# Altium schematic sheet IO and Connectors.SchDoc
size Letter; DocumentNumber: 6; SheetNumber: 6; SheetTotal: 7
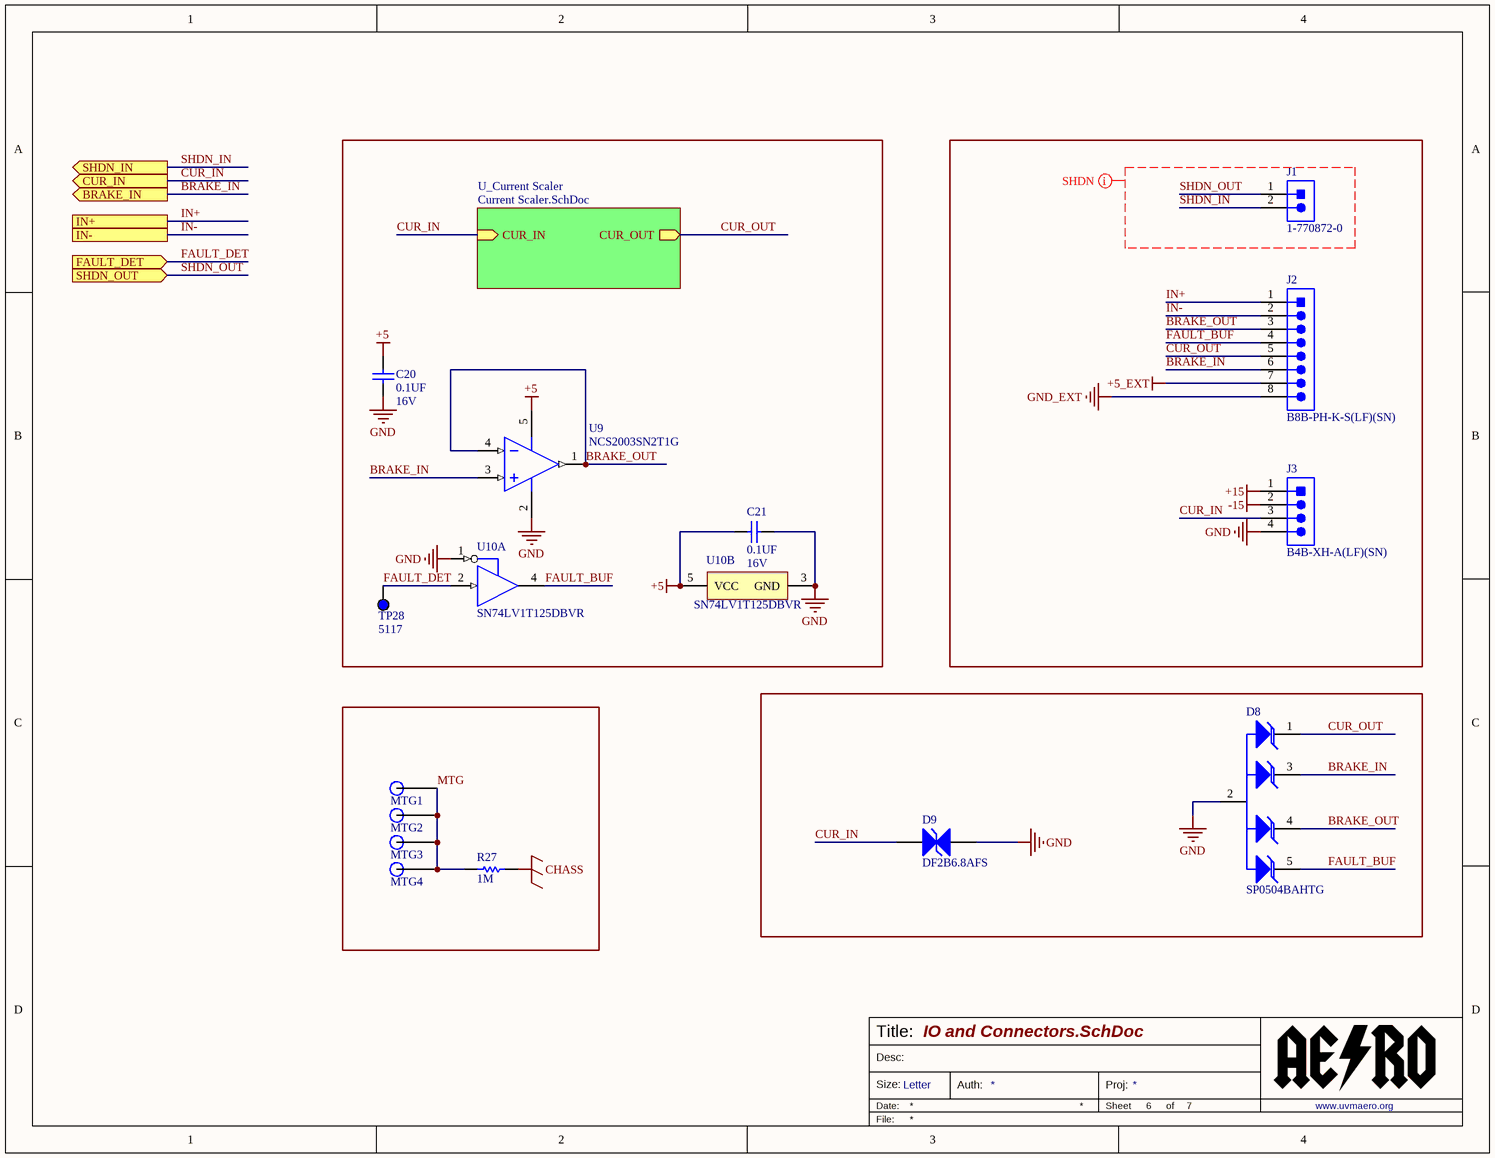
[diagram p0: IO and Connectors.SchDoc]

## Parts
C20  Val: 0.1UF  Vol: 16V  [0603_CAP]  (hidden comment: CAP 0603 0.1UF 16V 10% X7R)
C21  Val: 0.1UF  Vol: 16V  [0603_CAP]  (hidden comment: CAP 0603 0.1UF 16V 10% X7R)
D8  SP0504BAHTG  [SOT23127P600-8N]
D9  DF2B6.8AFS  [SOD923]
J1  1-770872-0  [CON2_1X2_P163_VM_ALT]
J2  B8B-PH-K-S(LF)(SN)  [B8B-PH-K]
J3  B4B-XH-A(LF)(SN)  [B4B-XH-A(LF)(SN)]
MTG1  PCB MTG M3  [MTG-M3]  (value not drawn)  (no BOM)
MTG2  PCB MTG M3  [MTG-M3]  (value not drawn)  (no BOM)
MTG3  PCB MTG M3  [MTG-M3]  (value not drawn)  (no BOM)
MTG4  PCB MTG M3  [MTG-M3]  (value not drawn)  (no BOM)
R27  value 1M  [RESC2013X60X35ML10T20]  (hidden comment: RT0805BRE071ML)
TP28  5117  [KSTN-5117]
U9  NCS2003SN2T1G  [ONSC-TSOP-5-483-02_V]
U10  SN74LV1T125DBVR  [DBV0005A_M]  (parts A,B of 2)

## Sub-sheets
U_Current Scaler = Current Scaler.SchDoc: CUR_IN (in), CUR_OUT (out)

## Ports
BRAKE_IN (out), CUR_IN (out), FAULT_DET (in), IN+, IN-, SHDN_IN (out), SHDN_OUT (in)

## Nets
+5: C20.2 C21.2 U9.5(VDD) U10.5(VCC)
+5_EXT: J2.7
+15: J3.1
-15: J3.2
CHASS: R27.1
GND: C20.1 C21.1 D8.2 D9.2(A2) J3.4 U9.2(VSS) U10.1(~{OE}) U10.3(GND)
GND_EXT: J2.8
BRAKE_IN: D8.3 J2.6 U9.3(IN+) ; port BRAKE_IN
BRAKE_OUT: D8.4 J2.3 U9.1(VOUT) U9.4(IN-)
CUR_IN: D9.1(A1) J3.3 ; port CUR_IN, sheet U_Current Scaler/CUR_IN
CUR_OUT: D8.1 J2.5 ; sheet U_Current Scaler/CUR_OUT
FAULT_BUF: D8.5 J2.4 U10.4(Y)
FAULT_DET: TP28.1 U10.2(A) ; port FAULT_DET
IN+: J2.1 ; port IN+
IN-: J2.2 ; port IN-
MTG: MTG1.1 MTG2.1 MTG3.1 MTG4.1 R27.2
SHDN_IN: J1.2 ; port SHDN_IN
SHDN_OUT: J1.1 ; port SHDN_OUT

## Layout directives
net class PWR; net class HC: SHDN_IN, SHDN_OUT

## Notes on the sheet
- Title:
- Size:
- Date:
- Desc:
- Letter
- Auth:
- Sheet
- Proj:
- of
- www.uvmaero.org
- File:

## Library data of the parts
C20 C21 = CAP 0603 0.1UF 16V 10% X7R: Capacitor Surface Mount 0603 Footprint 0.1UF 16V 10% Tolerance Ceramic X7R; Manufacturer: Various; PCB Package: 0603; Description in Visual: Cap SMT 0603 0.1UF 16V 10%  Cer X7R; P/N: CAP 0603 0.1UF 16V 10% X7R; Manufacturer P/N: Various; Value: 0.1UF; Voltage: 16V; Tolerance: 10%; Type: Ceramic X7R; ComponentLink1Description: Manufacturer Website; ComponentLink2Description: Component Datasheet; ComponentLink3Description: Octopart Link
D8 = SP0504BAHTG: 8.5V Clamp  Ipp Tvs Diode Surface Mount SOT-23-5 5.5V; Manufacturer: Littelfuse; Capacitance: 30pF; Diode Type: Avalanche; Direction: Unidirectional; Element Configuration: Common Anode; ESD Protection: Yes; Leakage Current: 100nA; Max Power Dissipation: 225mW; Number of Channels: 4; Polarity: Bidirectional,Unidirectional; Power Line Protection: No; Voltage Rating (DC): 5V; Breakdown Voltage: 5.5V; Case/Package: SOT-23; Category: TVS Diodes; Clamping Voltage: 8.5V; Composition: Zener; Depth: 1.75mm; Height: 1.3mm; Lead Free: Lead Free; Length: 3.05mm; Manufacturer Part Number: SP0504BAHTG; Max Operating Temperature: 85°C; Max Reverse Leakage Current: 100nA; Min Operating Temperature: -40°C; Mount: Surface Mount; Number of Elements: 4; Number of Pins: 5; Number of Unidirectional Channels: 4; Packaging: Tape and Reel; Peak Pulse Power: 225mW; Power Dissipation: 225mW; Radiation Hardening: No; REACH SVHC: Unknown; Reverse Standoff Voltage: 5.5V; Termination: SMD/SMT; Width: 1.75mm; Working Voltage: 5.5V; Supplier 1: Digi-Key; Supplier Part Number 1: F3157CT-ND
D9 = DF2B6.8AFS: 7V (Typ) Clamp 1A (8/20µs) Ipp Tvs Diode Surface Mount fSC (SOD-923); Supplier 1: Digi-Key; Supplier Part Number 1: DF2B6.8AFSL3MCT-ND
J1 = 1-770872-0: Connector Header Through Hole 2 position 0.163" (4.14mm); Vendor: TE Connectivity; Built_By: EMA_UL_Team; Manufacturer_Part_Number: 1-770872-0; Copyright: Copyright (C) 2018 Accelerated Designs. All rights reserved; RefDes: RefDes; Type: DEV; Value: Value
J2 = B8B-PH-K-S(LF)(SN): Connector Header Through Hole 8 position 0.079" (2.00mm); Supplier 1: Digi-Key; Supplier Part Number 1: 455-1710-ND
J3 = B4B-XH-A(LF)(SN): Connector Header Through Hole 4 position 0.098" (2.50mm); Manufacturer: JST; No of Positions: 4; Style/Orientation: StraightHeader/Plug; Type: ShroudedHeader; Manufacturer URL: http://www.jst.com/home2.html; Termination: Crimp; Datasheet Version: Apr-09; Supplier 1: Newark; Supplier Part Number 1: 73M9436
MTG1-MTG4 = MTG M3: PCB Mounting for M3 Screw; P/N: MTG M3; PCB Package: M3
R27 = CMP-2001-01491-1: Manufacturer: Yageo; Part Number: RT0805BRE071ML
TP28 = 5117: Test Point, Blue, 1-Pin THD, RoHS, Bulk; Manufacturer: KeystoneElectronics; Outside Diameter: 2.54mm; Plating: Silver; Mounting Hole Size: 1mm; Product: TestPoints; Packaging: Bulk; Manufacturer URL: http://www.keyelco.com/; Length: 7.62mm; Datasheet Version: Rev. G, 12/2008; Type: Miniature; Product Category: CircuitBoardHardware-PCB; Material: Nylon; RoHS: True; Contact Material: PhosphorBronze; Datasheet URL: https://ciiva.com/datasheet-click-2917627?src=ciiva&sig=bd195616; Color: Blue; Brand: KeystoneElectronics; Supplier 1: Digi-Key; Supplier Part Number 1: 36-5117-ND
U9 = CMP-1310-00381-1: Low Voltage, Rail-to-Rail Output Operational Amplifier, 1.7 to 5.5 V, -40 to 85 degC, 5-Pin TSOP, Pb-Free, Tape and Reel; Manufacturer: On Semiconductor; VCC Max (V): 5.5; VCC Min (V): 1.7; ComponentLink3URL: http://www.onsemi.com/pub_link/Collateral/483.PDF; Packing: Tape and Reel; ComponentLink1URL: http://www.onsemi.com/; PackageReference: TSOP-5-483-02; Mounting Technology: Surface Mount; PackageVersion: Rev. K, 04/2013; PartNumber: NCS2003SN2T1G; DatasheetVersion: Rev. 3; ComponentLink2URL: http://www.onsemi.cn/pub_link/Collateral/NCS2003-D.PDF; ComponentLink2Description: Datasheet; ComponentLink3Description: Package Specification; RoHS: TRUE; PackageDescription: 5-Pin Small Outline Package, Body 3 x 1.5 mm, Pitch 0.95 mm; ComponentLink1Description: Manufacturer URL
U10 = CMP-0859-00122-3: Single Power Supply, Single BUFFER GATE w/ 3-State Output (active low enable), DBV0005A, LARGE T&R; Manufacturer: Texas Instruments; Schmitt Trigger: No; Sub-Family: Non-Inverting Buffer/Driver; Voltage(Nom)(V): 1.8,2.5,3.3,5.5; Output Drive (IOL/IOH)(Max)(mA): 8/-8; Bits(#): 1; Technology Family: LV1T; F @ Nom Voltage(Max)(Mhz): 50; Output Type: CMOS; Input Type: TTL; VCC(Min)(V): 1.6; tpd @ Nom Voltage(Max)(ns): 14.5,9.5,8.0,6.5; 3-State Output: Yes; ICC @ Nom Voltage(Max)(mA): 0.01; Rating: Catalog; Logic: True; Special Features: 1.8V to 3.3V Up Translation,3.3V to 1.8V Down Translation,5V Input Tolerant; VCC(Max)(V): 5.5; PackageReference: DBV0005A; Generic Part Number: SN74LV1T125; Operating Temperature Range(C): -40 to 125; DatasheetVersion: SCLS745A